# EAGLE schematic LEDMatrix (EAGLE 9.6.2)
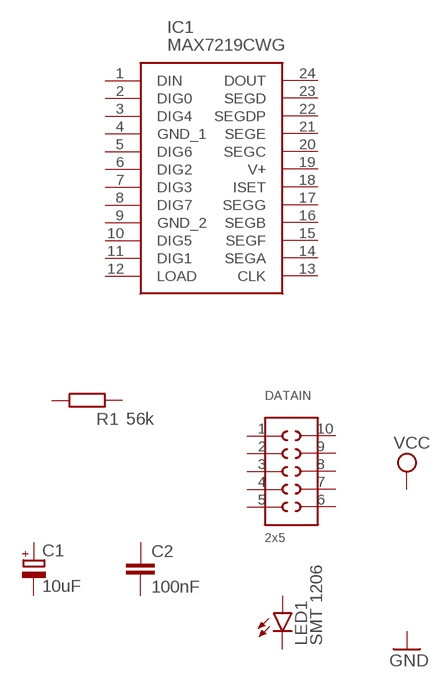
[diagram p0: schematic, sheet 1]

## Parts
C1  10uF  CPOL-EUE5-8.5  [E5-8,5]
C2  100nF  C-EUC1206  [C1206]
DATAIN  2x5  610X1021121  [610X1021121]
IC1  MAX7219CWG  [SOIC127P1032X265-24N]
LED1  SMT 1206  LEDCHIPLED_1206  [CHIPLED_1206]
R1  56k  R-EU_R1206  [R1206]
Unconnected: C1.+ C1.- C2.1 C2.2 DATAIN.1 DATAIN.2 DATAIN.3 DATAIN.4 DATAIN.5 DATAIN.6 DATAIN.7 DATAIN.8 DATAIN.9 DATAIN.10 IC1.1(DIN) IC1.2(DIG0) IC1.3(DIG4) IC1.4(GND_1) IC1.5(DIG6) IC1.6(DIG2) IC1.7(DIG3) IC1.8(DIG7) IC1.9(GND_2) IC1.10(DIG5) IC1.11(DIG1) IC1.12(LOAD) IC1.13(CLK) IC1.14(SEGA) IC1.15(SEGF) IC1.16(SEGB) IC1.17(SEGG) IC1.18(ISET) IC1.19(V+) IC1.20(SEGC) IC1.21(SEGE) IC1.22(SEGDP) IC1.23(SEGD) IC1.24(DOUT) LED1.A LED1.C R1.1 R1.2

## Library data of the parts
C1 = Clean-Kong:CPOL-EU: POLARIZED CAPACITOR, European symbol
C2 = rcl:C-EU: CAPACITOR, European symbol; SPICEPREFIX: C
DATAIN = Wurth_Elektronik_Electromechanic_Board_to_Board_Connectors_rev16a:610X1021121: WR-PHD 2.54mm Dual SMT Pin Header, 10 Pins =>Code : Con_BTB_PHD_2.54_2_610x1021121(packageing:x = 0: Tube x = 3: Tape & Reel with Cap; 300 pcs/Reel) <http://katalog.we-online.de/media/images/eican/Con_BTB_PHD_2.54_2_6100xx21121_pf2.jpg> 6100xx21121 Details see: http://katalog.we-online.de/en/em/610_0xx_211_21 6103xx21121 Details see: http://katalog.we-online.de/en/em/PHD_2_54_SMT_DUAL_PIN_HEADER_REEL_6103XX21121 2014 (C) Würth Elektronik
IC1 = MAX7219CWG:MAX7219CWG: IC DRVR 7 SEGMNT 8 DIGIT 24SOIC Source: Datasheet <http://datasheets.maximintegrated.com/en/ds/MAX7219-MAX7221.pdf>; DESCRIPTION: IC DRVR 7 SEGMNT 8 DIGIT 24SOIC; HEIGHT: 2.65mm; MANUFACTURER_NAME: Maxim Integrated; MANUFACTURER_PART_NUMBER: MAX7219CWG
LED1 = led:LED: LED OSRAM: - CHIPLED LG R971, LG N971, LY N971, LG Q971, LY Q971, LO R971, LY R971 LH N974, LH R974 LS Q976, LO Q976, LY Q976 LO Q996 - Hyper CHIPLED LW Q18S LB Q993, LB Q99A, LB R99A - SideLED LS A670, LO A670, LY A670, LG A670, LP A670 LB A673, LV A673, LT A673, LW A673 LH A674 LY A675 LS A676, LA A676, LO A676, LY A676, LW A676 LS A679, LY A679, LG A679 - Hyper Micro SIDELED® LS Y876, LA Y876, LO Y876, LY Y876 LT Y87S - SmartLED LW L88C, LW L88S LB L89C, LB L89S, LG L890 LS L89K, LO L89K, LY L89K LS L896, LA L896, LO L896, LY L896 - TOPLED LS T670, LO T670, LY T670, LG T670, LP T670 LSG T670, LSP T670, LSY T670, LOP T670, LYG T670 LG T671, LOG T671, LSG T671 LB T673, LV T673, LT T673, LW T673 LH T674 LS T676, LA T676, LO T676, LY T676, LB T676, LH T676, LSB T676, LW T676 LB T67C, LV T67C, LT T67C, LS T67K, LO T67K, LY T67K, LW E67C LS E67B, LA E67B, LO E67B, LY E67B, LB E67C, LV E67C, LT E67C LW T67C LS T679, LY T679, LG T679 LS T770, LO T770, LY T770, LG T770, LP T770 LB T773, LV T773, LT T773, LW T773 LH T774 LS E675, LA E675, LY E675, LS T675 LS T776, LA T776, LO T776, LY T776, LB T776 LHGB T686 LT T68C, LB T68C - Hyper Mini TOPLED® LB M676 - Mini TOPLED Santana® LG M470 LS M47K, LO M47K, LY M47K Source: http://www.osram.convergy.de LUXEON: - LUMILED® LXK2-PW12-R00, LXK2-PW12-S00, LXK2-PW14-U00, LXK2-PW14-V00 LXK2-PM12-R00, LXK2-PM12-S00, LXK2-PM14-U00 LXK2-PE12-Q00, LXK2-PE12-R00, LXK2-PE12-S00, LXK2-PE14-T00, LXK2-PE14-U00 LXK2-PB12-K00, LXK2-PB12-L00, LXK2-PB12-M00, LXK2-PB14-N00, LXK2-PB14-P00, LXK2-PB14-Q00 LXK2-PR12-L00, LXK2-PR12-M00, LXK2-PR14-Q00, LXK2-PR14-R00 LXK2-PD12-Q00, LXK2-PD12-R00, LXK2-PD12-S00 LXK2-PH12-R00, LXK2-PH12-S00 LXK2-PL12-P00, LXK2-PL12-Q00, LXK2-PL12-R00 Source: www.luxeon.com KINGBRIGHT: KA-3528ASYC Source: www.kingbright.com
R1 = rcl:R-EU_: RESISTOR, European symbol; SPICEPREFIX: R